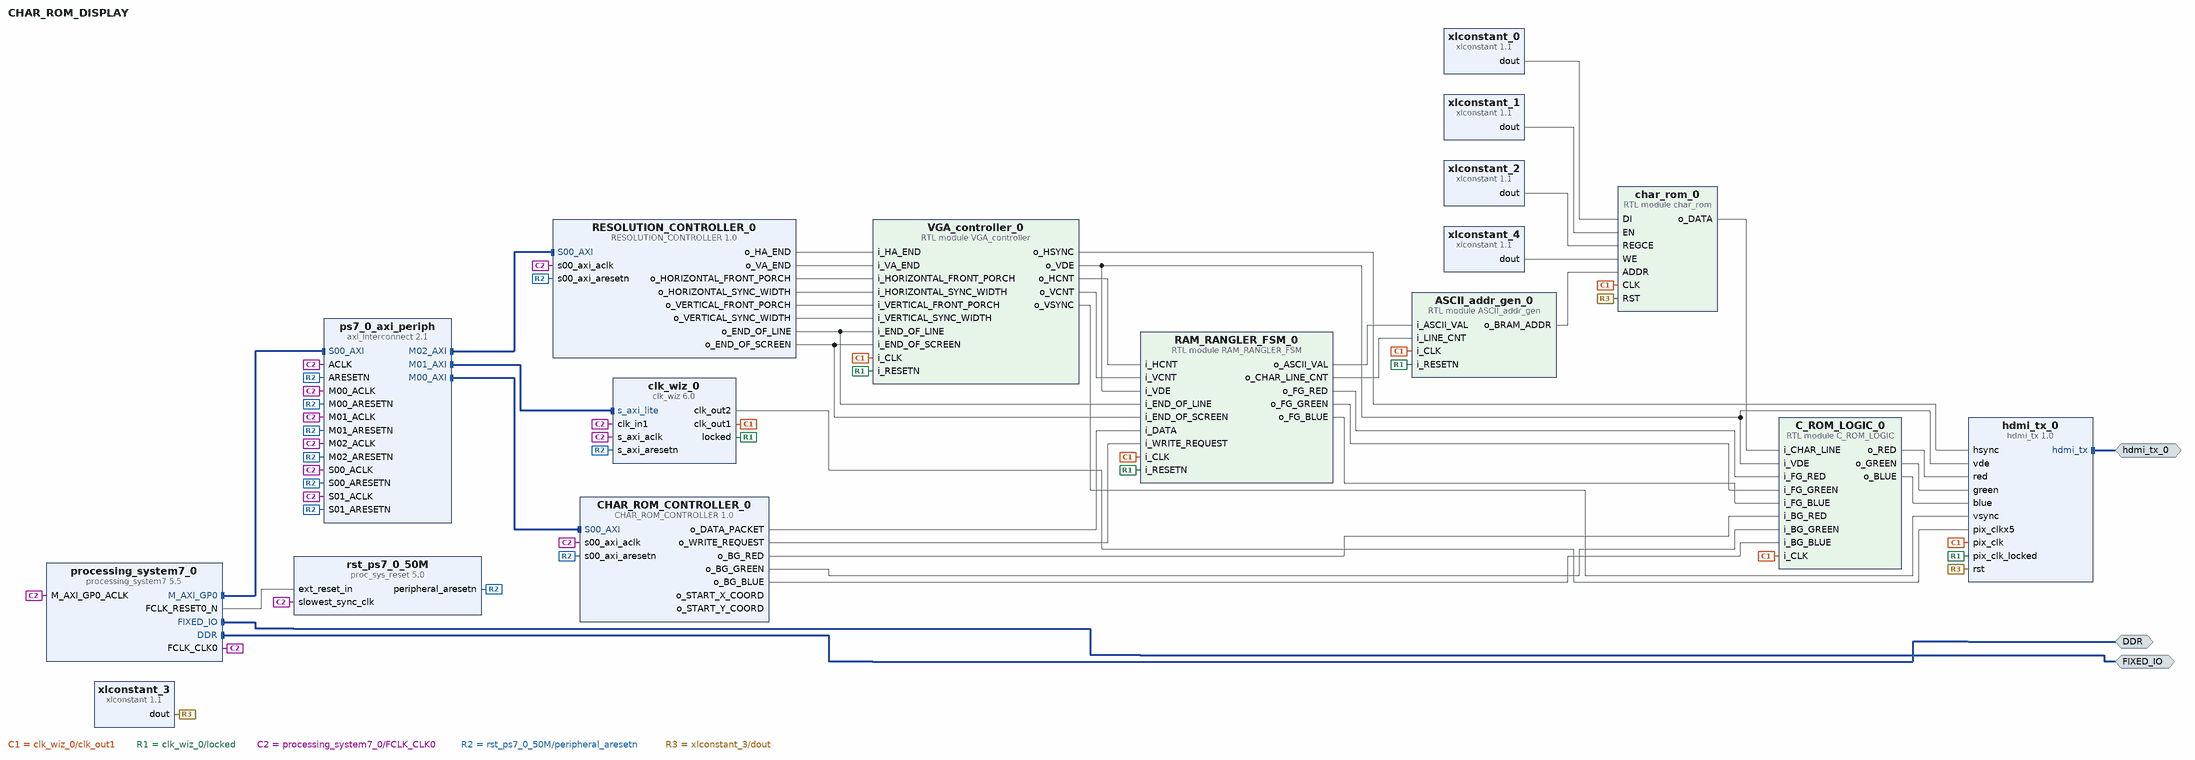
[diagram p0: block diagram of the top level]
# Vivado block design CHAR_ROM_DISPLAY, xc7z007sclg400-1, Vivado 2019.1
create_bd_design CHAR_ROM_DISPLAY

create_bd_intf_port -mode Master -vlnv xilinx.com:interface:hdmi_rtl:2.0 hdmi_tx_0
create_bd_intf_port -mode Master -vlnv xilinx.com:interface:ddrx_rtl:1.0 DDR
create_bd_intf_port -mode Master -vlnv xilinx.com:display_processing_system7:fixedio_rtl:1.0 FIXED_IO

create_bd_cell -type ip -vlnv xilinx.com:ip:clk_wiz:6.0 clk_wiz_0
set_property -dict [list \
  CONFIG.CLKIN1_JITTER_PS 100.0 \
  CONFIG.CLKOUT1_JITTER 337.616 \
  CONFIG.CLKOUT1_PHASE_ERROR 322.999 \
  CONFIG.CLKOUT1_REQUESTED_OUT_FREQ 74.25 \
  CONFIG.CLKOUT1_REQUESTED_PHASE 25 \
  CONFIG.CLKOUT2_JITTER 258.703 \
  CONFIG.CLKOUT2_PHASE_ERROR 322.999 \
  CONFIG.CLKOUT2_REQUESTED_OUT_FREQ 371.25 \
  CONFIG.CLKOUT2_REQUESTED_PHASE 25 \
  CONFIG.CLKOUT2_USED true \
  CONFIG.MMCM_CLKFBOUT_MULT_F 37.125 \
  CONFIG.MMCM_CLKIN1_PERIOD 10.000 \
  CONFIG.MMCM_CLKIN2_PERIOD 10.000 \
  CONFIG.MMCM_CLKOUT0_DIVIDE_F 10.000 \
  CONFIG.MMCM_CLKOUT0_PHASE 27.000 \
  CONFIG.MMCM_CLKOUT1_DIVIDE 2 \
  CONFIG.MMCM_CLKOUT1_PHASE 22.500 \
  CONFIG.MMCM_DIVCLK_DIVIDE 5 \
  CONFIG.NUM_OUT_CLKS 2 \
  CONFIG.PRIM_IN_FREQ 100 \
  CONFIG.USE_DYN_RECONFIG true \
] [get_bd_cells clk_wiz_0]
create_bd_cell -type ip -vlnv realdigital.org:realdigital:hdmi_tx:1.0 hdmi_tx_0
set_property -dict {CONFIG.MODE HDMI} [get_bd_cells hdmi_tx_0]
create_bd_cell -type ip -vlnv xilinx.com:ip:processing_system7:5.5 processing_system7_0
set_property -dict [list \
  CONFIG.PCW_FPGA0_PERIPHERAL_FREQMHZ 100 \
  CONFIG.PCW_GPIO_MIO_GPIO_ENABLE 1 \
  CONFIG.PCW_GPIO_MIO_GPIO_IO MIO \
  CONFIG.PCW_I2C_RESET_ENABLE 1 \
  CONFIG.PCW_QSPI_GRP_FBCLK_ENABLE 1 \
  CONFIG.PCW_QSPI_GRP_FBCLK_IO {MIO 8} \
  CONFIG.PCW_QSPI_GRP_SINGLE_SS_ENABLE 1 \
  CONFIG.PCW_QSPI_GRP_SINGLE_SS_IO {MIO 1 .. 6} \
  CONFIG.PCW_QSPI_PERIPHERAL_ENABLE 1 \
  CONFIG.PCW_QSPI_QSPI_IO {MIO 1 .. 6} \
  CONFIG.PCW_SD0_GRP_CD_ENABLE 1 \
  CONFIG.PCW_SD0_GRP_CD_IO {MIO 47} \
  CONFIG.PCW_SD0_GRP_WP_ENABLE 0 \
  CONFIG.PCW_SD0_PERIPHERAL_ENABLE 1 \
  CONFIG.PCW_SD0_SD0_IO {MIO 40 .. 45} \
  CONFIG.PCW_SDIO_PERIPHERAL_FREQMHZ 100 \
  CONFIG.PCW_SINGLE_QSPI_DATA_MODE x4 \
  CONFIG.PCW_SPI1_PERIPHERAL_ENABLE 1 \
  CONFIG.PCW_SPI1_SPI1_IO {MIO 10 .. 15} \
  CONFIG.PCW_UART0_PERIPHERAL_ENABLE 1 \
  CONFIG.PCW_UART0_UART0_IO {MIO 14 .. 15} \
  CONFIG.PCW_UART1_PERIPHERAL_ENABLE 0 \
  CONFIG.PCW_UART_PERIPHERAL_FREQMHZ 100 \
  CONFIG.PCW_UIPARAM_DDR_BUS_WIDTH {16 Bit} \
  CONFIG.PCW_UIPARAM_DDR_MEMORY_TYPE {DDR 3 (Low Voltage)} \
  CONFIG.PCW_UIPARAM_DDR_PARTNO Custom \
  CONFIG.PCW_USB0_PERIPHERAL_ENABLE 1 \
  CONFIG.PCW_USB0_RESET_ENABLE 1 \
  CONFIG.PCW_USB0_RESET_IO {MIO 46} \
  CONFIG.PCW_USB0_USB0_IO {MIO 28 .. 39} \
  CONFIG.PCW_USB_RESET_ENABLE 1 \
  CONFIG.PCW_USB_RESET_SELECT {Share reset pin} \
] [get_bd_cells processing_system7_0]
# 223 more settings of processing_system7_0 are not shown: defaults, MIO pin electricals, DDR timing, and values the tool derives
create_bd_cell -type ip -vlnv xilinx.com:ip:axi_interconnect:2.1 ps7_0_axi_periph
set_property -dict [list \
  CONFIG.ENABLE_ADVANCED_OPTIONS 1 \
  CONFIG.M00_HAS_DATA_FIFO 1 \
  CONFIG.M00_HAS_REGSLICE 4 \
  CONFIG.NUM_MI 3 \
  CONFIG.NUM_SI 2 \
  CONFIG.S00_HAS_DATA_FIFO 1 \
  CONFIG.S00_HAS_REGSLICE 4 \
] [get_bd_cells ps7_0_axi_periph]
create_bd_cell -type ip -vlnv xilinx.com:ip:proc_sys_reset:5.0 rst_ps7_0_50M
create_bd_cell -type ip -vlnv xilinx.com:ip:xlconstant:1.1 xlconstant_0
set_property -dict {CONFIG.CONST_VAL 0 CONFIG.CONST_WIDTH 16} [get_bd_cells xlconstant_0]
create_bd_cell -type ip -vlnv xilinx.com:ip:xlconstant:1.1 xlconstant_1
set_property -dict {CONFIG.CONST_WIDTH 1} [get_bd_cells xlconstant_1]
create_bd_cell -type ip -vlnv xilinx.com:ip:xlconstant:1.1 xlconstant_2
set_property -dict {CONFIG.CONST_VAL 0 CONFIG.CONST_WIDTH 1} [get_bd_cells xlconstant_2]
create_bd_cell -type ip -vlnv xilinx.com:ip:xlconstant:1.1 xlconstant_3
set_property -dict {CONFIG.CONST_VAL 0 CONFIG.CONST_WIDTH 1} [get_bd_cells xlconstant_3]
create_bd_cell -type ip -vlnv xilinx.com:ip:xlconstant:1.1 xlconstant_4
set_property -dict {CONFIG.CONST_VAL 0 CONFIG.CONST_WIDTH 2} [get_bd_cells xlconstant_4]
create_bd_cell -type module -reference char_rom char_rom_0
create_bd_cell -type ip -vlnv user.org:user:CHAR_ROM_CONTROLLER:1.0 CHAR_ROM_CONTROLLER_0
create_bd_cell -type module -reference ASCII_addr_gen ASCII_addr_gen_0
create_bd_cell -type ip -vlnv user.org:user:RESOLUTION_CONTROLLER:1.0 RESOLUTION_CONTROLLER_0
create_bd_cell -type module -reference VGA_controller VGA_controller_0
create_bd_cell -type module -reference C_ROM_LOGIC C_ROM_LOGIC_0
create_bd_cell -type module -reference RAM_RANGLER_FSM RAM_RANGLER_FSM_0

# ---- connections ----

connect_bd_intf_net [get_bd_intf_pins ps7_0_axi_periph/M01_AXI] [get_bd_intf_pins clk_wiz_0/s_axi_lite]
connect_bd_intf_net [get_bd_intf_pins processing_system7_0/M_AXI_GP0] [get_bd_intf_pins ps7_0_axi_periph/S00_AXI]
connect_bd_intf_net [get_bd_intf_ports FIXED_IO] [get_bd_intf_pins processing_system7_0/FIXED_IO]
connect_bd_intf_net [get_bd_intf_pins ps7_0_axi_periph/M02_AXI] [get_bd_intf_pins RESOLUTION_CONTROLLER_0/S00_AXI]
connect_bd_intf_net [get_bd_intf_ports DDR] [get_bd_intf_pins processing_system7_0/DDR]
connect_bd_intf_net [get_bd_intf_ports hdmi_tx_0] [get_bd_intf_pins hdmi_tx_0/hdmi_tx]
connect_bd_intf_net [get_bd_intf_pins ps7_0_axi_periph/M00_AXI] [get_bd_intf_pins CHAR_ROM_CONTROLLER_0/S00_AXI]
connect_bd_net [get_bd_pins VGA_controller_0/o_HSYNC] [get_bd_pins hdmi_tx_0/hsync]
connect_bd_net [get_bd_pins VGA_controller_0/o_VDE] \
  [get_bd_pins hdmi_tx_0/vde] [get_bd_pins C_ROM_LOGIC_0/i_VDE] [get_bd_pins RAM_RANGLER_FSM_0/i_VDE]
connect_bd_net [get_bd_pins VGA_controller_0/o_VSYNC] [get_bd_pins hdmi_tx_0/vsync]
connect_bd_net [get_bd_pins clk_wiz_0/clk_out1] \
  [get_bd_pins hdmi_tx_0/pix_clk] [get_bd_pins char_rom_0/CLK] [get_bd_pins ASCII_addr_gen_0/i_CLK] \
  [get_bd_pins VGA_controller_0/i_CLK] [get_bd_pins C_ROM_LOGIC_0/i_CLK] [get_bd_pins RAM_RANGLER_FSM_0/i_CLK]
connect_bd_net [get_bd_pins clk_wiz_0/clk_out2] [get_bd_pins hdmi_tx_0/pix_clkx5]
connect_bd_net [get_bd_pins clk_wiz_0/locked] \
  [get_bd_pins hdmi_tx_0/pix_clk_locked] [get_bd_pins ASCII_addr_gen_0/i_RESETN] [get_bd_pins VGA_controller_0/i_RESETN] \
  [get_bd_pins RAM_RANGLER_FSM_0/i_RESETN]
connect_bd_net [get_bd_pins ASCII_addr_gen_0/o_BRAM_ADDR] [get_bd_pins char_rom_0/ADDR]
connect_bd_net [get_bd_pins processing_system7_0/FCLK_CLK0] \
  [get_bd_pins processing_system7_0/M_AXI_GP0_ACLK] [get_bd_pins ps7_0_axi_periph/S00_ACLK] \
  [get_bd_pins rst_ps7_0_50M/slowest_sync_clk] [get_bd_pins ps7_0_axi_periph/M00_ACLK] [get_bd_pins ps7_0_axi_periph/ACLK] \
  [get_bd_pins clk_wiz_0/s_axi_aclk] [get_bd_pins ps7_0_axi_periph/M01_ACLK] [get_bd_pins ps7_0_axi_periph/S01_ACLK] \
  [get_bd_pins ps7_0_axi_periph/M02_ACLK] [get_bd_pins CHAR_ROM_CONTROLLER_0/s00_axi_aclk] [get_bd_pins clk_wiz_0/clk_in1] \
  [get_bd_pins RESOLUTION_CONTROLLER_0/s00_axi_aclk]
connect_bd_net [get_bd_pins processing_system7_0/FCLK_RESET0_N] [get_bd_pins rst_ps7_0_50M/ext_reset_in]
connect_bd_net [get_bd_pins rst_ps7_0_50M/peripheral_aresetn] \
  [get_bd_pins ps7_0_axi_periph/S00_ARESETN] [get_bd_pins ps7_0_axi_periph/M00_ARESETN] \
  [get_bd_pins ps7_0_axi_periph/ARESETN] [get_bd_pins clk_wiz_0/s_axi_aresetn] [get_bd_pins ps7_0_axi_periph/M01_ARESETN] \
  [get_bd_pins ps7_0_axi_periph/S01_ARESETN] [get_bd_pins ps7_0_axi_periph/M02_ARESETN] \
  [get_bd_pins CHAR_ROM_CONTROLLER_0/s00_axi_aresetn] [get_bd_pins RESOLUTION_CONTROLLER_0/s00_axi_aresetn]
connect_bd_net [get_bd_pins C_ROM_LOGIC_0/o_RED] [get_bd_pins hdmi_tx_0/red]
connect_bd_net [get_bd_pins C_ROM_LOGIC_0/o_GREEN] [get_bd_pins hdmi_tx_0/green]
connect_bd_net [get_bd_pins C_ROM_LOGIC_0/o_BLUE] [get_bd_pins hdmi_tx_0/blue]
connect_bd_net -net char_rom_0_DO [get_bd_pins char_rom_0/o_DATA] [get_bd_pins C_ROM_LOGIC_0/i_CHAR_LINE]
connect_bd_net [get_bd_pins xlconstant_0/dout] [get_bd_pins char_rom_0/DI]
connect_bd_net [get_bd_pins xlconstant_1/dout] [get_bd_pins char_rom_0/EN]
connect_bd_net [get_bd_pins xlconstant_2/dout] [get_bd_pins char_rom_0/REGCE]
connect_bd_net [get_bd_pins xlconstant_3/dout] [get_bd_pins hdmi_tx_0/rst] [get_bd_pins char_rom_0/RST]
connect_bd_net [get_bd_pins xlconstant_4/dout] [get_bd_pins char_rom_0/WE]
connect_bd_net -net CHAR_ROM_CONTROLLER_0_o_ASCII_VAL [get_bd_pins RAM_RANGLER_FSM_0/o_ASCII_VAL] [get_bd_pins ASCII_addr_gen_0/i_ASCII_VAL]
# net CHAR_ROM_CONTROLLER_0_o_START_X_COORD has one end: CHAR_ROM_CONTROLLER_0/o_START_X_COORD
# net CHAR_ROM_CONTROLLER_0_o_START_Y_COORD has one end: CHAR_ROM_CONTROLLER_0/o_START_Y_COORD
connect_bd_net [get_bd_pins CHAR_ROM_CONTROLLER_0/o_BG_RED] [get_bd_pins C_ROM_LOGIC_0/i_BG_RED]
connect_bd_net [get_bd_pins CHAR_ROM_CONTROLLER_0/o_BG_GREEN] [get_bd_pins C_ROM_LOGIC_0/i_BG_GREEN]
connect_bd_net [get_bd_pins CHAR_ROM_CONTROLLER_0/o_BG_BLUE] [get_bd_pins C_ROM_LOGIC_0/i_BG_BLUE]
connect_bd_net -net CHAR_ROM_CONTROLLER_0_o_FG_RED [get_bd_pins RAM_RANGLER_FSM_0/o_FG_RED] [get_bd_pins C_ROM_LOGIC_0/i_FG_RED]
connect_bd_net -net CHAR_ROM_CONTROLLER_0_o_FG_GREEN [get_bd_pins RAM_RANGLER_FSM_0/o_FG_GREEN] [get_bd_pins C_ROM_LOGIC_0/i_FG_GREEN]
connect_bd_net -net CHAR_ROM_CONTROLLER_0_o_FG_BLUE [get_bd_pins RAM_RANGLER_FSM_0/o_FG_BLUE] [get_bd_pins C_ROM_LOGIC_0/i_FG_BLUE]
connect_bd_net [get_bd_pins RESOLUTION_CONTROLLER_0/o_END_OF_LINE] \
  [get_bd_pins VGA_controller_0/i_END_OF_LINE] [get_bd_pins RAM_RANGLER_FSM_0/i_END_OF_LINE]
connect_bd_net [get_bd_pins RESOLUTION_CONTROLLER_0/o_END_OF_SCREEN] \
  [get_bd_pins VGA_controller_0/i_END_OF_SCREEN] [get_bd_pins RAM_RANGLER_FSM_0/i_END_OF_SCREEN]
connect_bd_net [get_bd_pins CHAR_ROM_CONTROLLER_0/o_DATA_PACKET] [get_bd_pins RAM_RANGLER_FSM_0/i_DATA]
connect_bd_net [get_bd_pins VGA_controller_0/o_HCNT] [get_bd_pins RAM_RANGLER_FSM_0/i_HCNT]
connect_bd_net [get_bd_pins VGA_controller_0/o_VCNT] [get_bd_pins RAM_RANGLER_FSM_0/i_VCNT]
connect_bd_net [get_bd_pins RAM_RANGLER_FSM_0/o_CHAR_LINE_CNT] [get_bd_pins ASCII_addr_gen_0/i_LINE_CNT]
connect_bd_net [get_bd_pins CHAR_ROM_CONTROLLER_0/o_WRITE_REQUEST] [get_bd_pins RAM_RANGLER_FSM_0/i_WRITE_REQUEST]
connect_bd_net [get_bd_pins RESOLUTION_CONTROLLER_0/o_HA_END] [get_bd_pins VGA_controller_0/i_HA_END]
connect_bd_net [get_bd_pins RESOLUTION_CONTROLLER_0/o_VA_END] [get_bd_pins VGA_controller_0/i_VA_END]
connect_bd_net [get_bd_pins RESOLUTION_CONTROLLER_0/o_HORIZONTAL_FRONT_PORCH] [get_bd_pins VGA_controller_0/i_HORIZONTAL_FRONT_PORCH]
connect_bd_net [get_bd_pins RESOLUTION_CONTROLLER_0/o_HORIZONTAL_SYNC_WIDTH] [get_bd_pins VGA_controller_0/i_HORIZONTAL_SYNC_WIDTH]
connect_bd_net [get_bd_pins RESOLUTION_CONTROLLER_0/o_VERTICAL_FRONT_PORCH] [get_bd_pins VGA_controller_0/i_VERTICAL_FRONT_PORCH]
connect_bd_net [get_bd_pins RESOLUTION_CONTROLLER_0/o_VERTICAL_SYNC_WIDTH] [get_bd_pins VGA_controller_0/i_VERTICAL_SYNC_WIDTH]

# ---- address map ----
assign_bd_address -offset 0x43C00000 -range 64K -target_address_space [get_bd_addr_spaces processing_system7_0/Data] [get_bd_addr_segs RESOLUTION_CONTROLLER_0/S00_AXI/S00_AXI_reg]
assign_bd_address -offset 0x4BB00000 -range 4K -target_address_space [get_bd_addr_spaces processing_system7_0/Data] [get_bd_addr_segs CHAR_ROM_CONTROLLER_0/S00_AXI/S00_AXI_reg]
assign_bd_address -offset 0x4CC00000 -range 4K -target_address_space [get_bd_addr_spaces processing_system7_0/Data] [get_bd_addr_segs clk_wiz_0/s_axi_lite/Reg]

validate_bd_design
save_bd_design
